# Altium project YYB_V2.PrjPcb
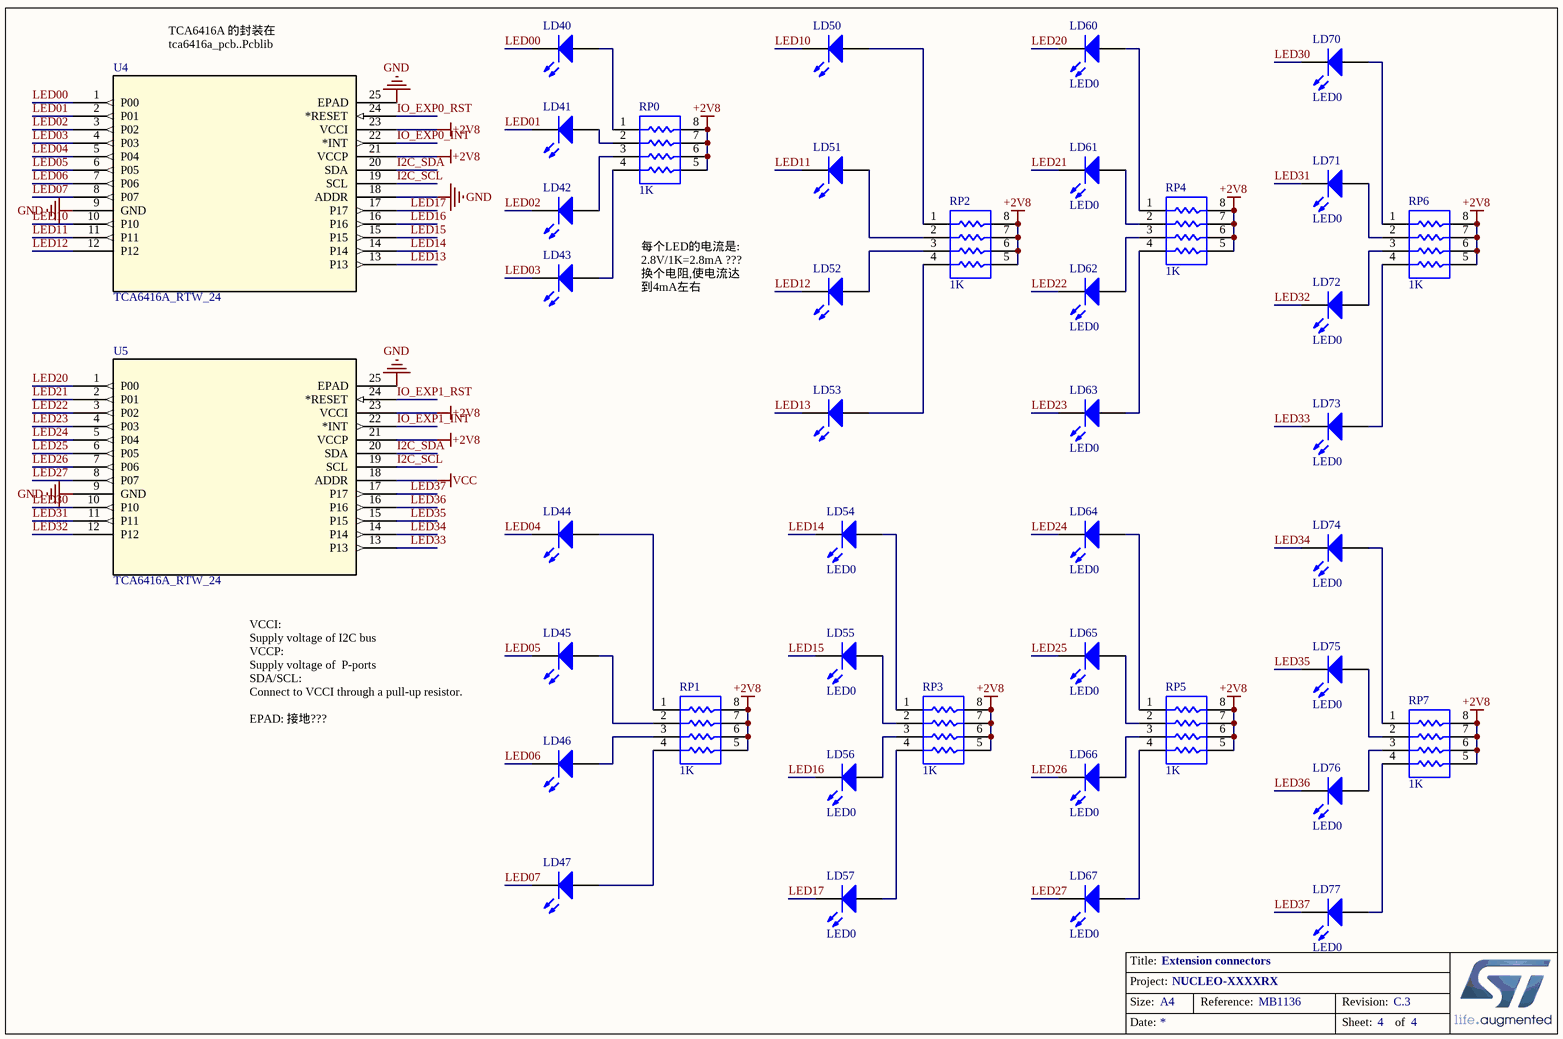
[diagram p0: yyb_v2_Leds.SchDoc]
3 sheets, 95 parts. Net scope: global (net labels, ports and power ports of the same name join across sheets).
Board file: ref_400059.PcbDoc
Sheets:
  yyb_v2_Leds.SchDoc
  ref_pca20006.SchDoc
  yyb_v2_modify.SchDoc

## Sheet yyb_v2_Leds.SchDoc: Extension connectors
size A4; DocumentNumber: MB1136; Revision: C.3; SheetNumber: 4; SheetTotal: 4; Project: NUCLEO-XXXXRX

### Parts
LD40  LED0  [LED5]  (value not drawn)
LD41  LED0  [LED5]  (value not drawn)
LD42  LED0  [LED5]  (value not drawn)
LD43  LED0  [LED5]  (value not drawn)
LD44  LED0  [LED-0]  (value not drawn)
LD45  LED0  [LED-0]  (value not drawn)
LD46  LED0  [LED-0]  (value not drawn)
LD47  LED0  [LED-0]  (value not drawn)
LD50  LED0  [LED-0]  (value not drawn)
LD51  LED0  [LED-0]  (value not drawn)
LD52  LED0  [LED-0]  (value not drawn)
LD53  LED0  [LED-0]  (value not drawn)
LD54  LED0  [LED5]
LD55  LED0  [LED5]
LD56  LED0  [LED5]
LD57  LED0  [LED5]
LD60  LED0  [LED5]
LD61  LED0  [LED5]
LD62  LED0  [LED5]
LD63  LED0  [LED5]
LD64  LED0  [LED5]
LD65  LED0  [LED5]
LD66  LED0  [LED5]
LD67  LED0  [LED5]
LD70  LED0  [LED5]
LD71  LED0  [LED5]
LD72  LED0  [LED5]
LD73  LED0  [LED5]
LD74  LED0  [LED5]
LD75  LED0  [LED5]
LD76  LED0  [LED5]
LD77  LED0  [LED5]
RP0  1K  [4P8]
RP1  1K  [4P8]
RP2  1K  [4P8]
RP3  1K  [4P8]
RP4  1K  [4P8]
RP5  1K  [4P8]
RP6  1K  [4P8]
RP7  1K  [4P8]
U4  TCA6416A_RTW_24  [RTW24_2P45X2P45]
U5  TCA6416A_RTW_24  [RTW24_2P45X2P45]

### Nets
+2V8: RP0.5 RP0.6 RP0.7 RP0.8 RP1.5 RP1.6 RP1.7 RP1.8 RP2.5 RP2.6 RP2.7 RP2.8 RP3.5 RP3.6 RP3.7 RP3.8 RP4.5 RP4.6 RP4.7 RP4.8 RP5.5 RP5.6 RP5.7 RP5.8 RP6.5 RP6.6 RP6.7 RP6.8 RP7.5 RP7.6 RP7.7 RP7.8 U4.21(VCCP) U4.23(VCCI) U5.21(VCCP) U5.23(VCCI)
GND: U4.9(GND) U4.18(ADDR) U4.25(EPAD) U5.9(GND) U5.25(EPAD)
VCC: U5.18(ADDR)
I2C_SCL: U4.19(SCL) U5.19(SCL)
I2C_SDA: U4.20(SDA) U5.20(SDA)
IO_EXP0_INT: U4.22(*INT)
IO_EXP0_RST: U4.24(*RESET)
IO_EXP1_INT: U5.22(*INT)
IO_EXP1_RST: U5.24(*RESET)
LED00: LD40.2(K) U4.1(P00)
LED01: LD41.2(K) U4.2(P01)
LED02: LD42.2(K) U4.3(P02)
LED03: LD43.2(K) U4.4(P03)
LED04: LD44.2(K) U4.5(P04)
LED05: LD45.2(K) U4.6(P05)
LED06: LD46.2(K) U4.7(P06)
LED07: LD47.2(K) U4.8(P07)
LED10: LD50.2(K) U4.10(P10)
LED11: LD51.2(K) U4.11(P11)
LED12: LD52.2(K) U4.12(P12)
LED13: LD53.2(K) U4.13(P13)
LED14: LD54.2(K) U4.14(P14)
LED15: LD55.2(K) U4.15(P15)
LED16: LD56.2(K) U4.16(P16)
LED17: LD57.2(K) U4.17(P17)
LED20: LD60.2(K) U5.1(P00)
LED21: LD61.2(K) U5.2(P01)
LED22: LD62.2(K) U5.3(P02)
LED23: LD63.2(K) U5.4(P03)
LED24: LD64.2(K) U5.5(P04)
LED25: LD65.2(K) U5.6(P05)
LED26: LD66.2(K) U5.7(P06)
LED27: LD67.2(K) U5.8(P07)
LED30: LD70.2(K) U5.10(P10)
LED31: LD71.2(K) U5.11(P11)
LED32: LD72.2(K) U5.12(P12)
LED33: LD73.2(K) U5.13(P13)
LED34: LD74.2(K) U5.14(P14)
LED35: LD75.2(K) U5.15(P15)
LED36: LD76.2(K) U5.16(P16)
LED37: LD77.2(K) U5.17(P17)
NetLD40_1: LD40.1(A) RP0.1
NetLD41_1: LD41.1(A) RP0.2
NetLD42_1: LD42.1(A) RP0.3
NetLD43_1: LD43.1(A) RP0.4
NetLD44_1: LD44.1(A) RP1.1
NetLD45_1: LD45.1(A) RP1.2
NetLD46_1: LD46.1(A) RP1.3
NetLD47_1: LD47.1(A) RP1.4
NetLD50_1: LD50.1(A) RP2.1
NetLD51_1: LD51.1(A) RP2.2
NetLD52_1: LD52.1(A) RP2.3
NetLD53_1: LD53.1(A) RP2.4
NetLD54_1: LD54.1(A) RP3.1
NetLD55_1: LD55.1(A) RP3.2
NetLD56_1: LD56.1(A) RP3.3
NetLD57_1: LD57.1(A) RP3.4
NetLD60_1: LD60.1(A) RP4.1
NetLD61_1: LD61.1(A) RP4.2
NetLD62_1: LD62.1(A) RP4.3
NetLD63_1: LD63.1(A) RP4.4
NetLD64_1: LD64.1(A) RP5.1
NetLD65_1: LD65.1(A) RP5.2
NetLD66_1: LD66.1(A) RP5.3
NetLD67_1: LD67.1(A) RP5.4
NetLD70_1: LD70.1(A) RP6.1
NetLD71_1: LD71.1(A) RP6.2
NetLD72_1: LD72.1(A) RP6.3
NetLD73_1: LD73.1(A) RP6.4
NetLD74_1: LD74.1(A) RP7.1
NetLD75_1: LD75.1(A) RP7.2
NetLD76_1: LD76.1(A) RP7.3
NetLD77_1: LD77.1(A) RP7.4

### Notes on the sheet
- (near U4) TCA6416A 的封装在tca6416a_pcb..Pcblib
- 每个LED的电流是:
  2.8V/1K=2.8mA ???
  换个电阻,使电流达到4mA左右
- VCCI:
  Supply voltage of I2C bus
  VCCP:
  Supply voltage of  P-ports
  SDA/SCL:
  Connect to VCCI through a pull-up resistor.
  EPAD: 接地???
- Title:
- Project:
- Size:
- Date:
- A4
- Reference:
- Sheet:
- Revision:
- of

### Library data of the parts
LD40-LD47 LD50-LD57 LD60-LD67 LD70-LD77 = LED0: Typical INFRARED GaAs LED; Published: 8-Jun-2000; LatestRevisionDate: 08-Jul-2005; LatestRevisionNote: Mech Layer 1 removed.; PackageReference: LED-0; Publisher: Altium Limited; PackageDescription: LED; 2 Leads
RP0-RP7 = RESPACK3_1
U4 U5 = TCA6416A_RTW_24: Imported; Manufacturer: Texas Instruments; INDUSTRY_STD_PKG_TYPE: QFN; FAMILY_NAME: I2C IO EXPANDER; PIN_COUNT: 24; PACKAGE_DESIGNATOR: RTW; Datasheet_URL: http://www.ti.com/lit/gpn/TCA6416A; GENERIC_PART_NUMBER: TCA6416A; Vendor: Texas Instruments; Manufacturer_Part_Number: tca6416a_rtw_24; Value: Value; Type: Type; RefDes: RefDes

## Sheet ref_pca20006.SchDoc: nRF51822 CoinCell design
size A4; Revision: 1.0.0; SheetNumber: 1; SheetTotal: 1; DrawnBy: RUBR; DocumentSize: A4; PCBRevision: 0138RUBR; PCAName: PCA20006; PCBNumber: 400059
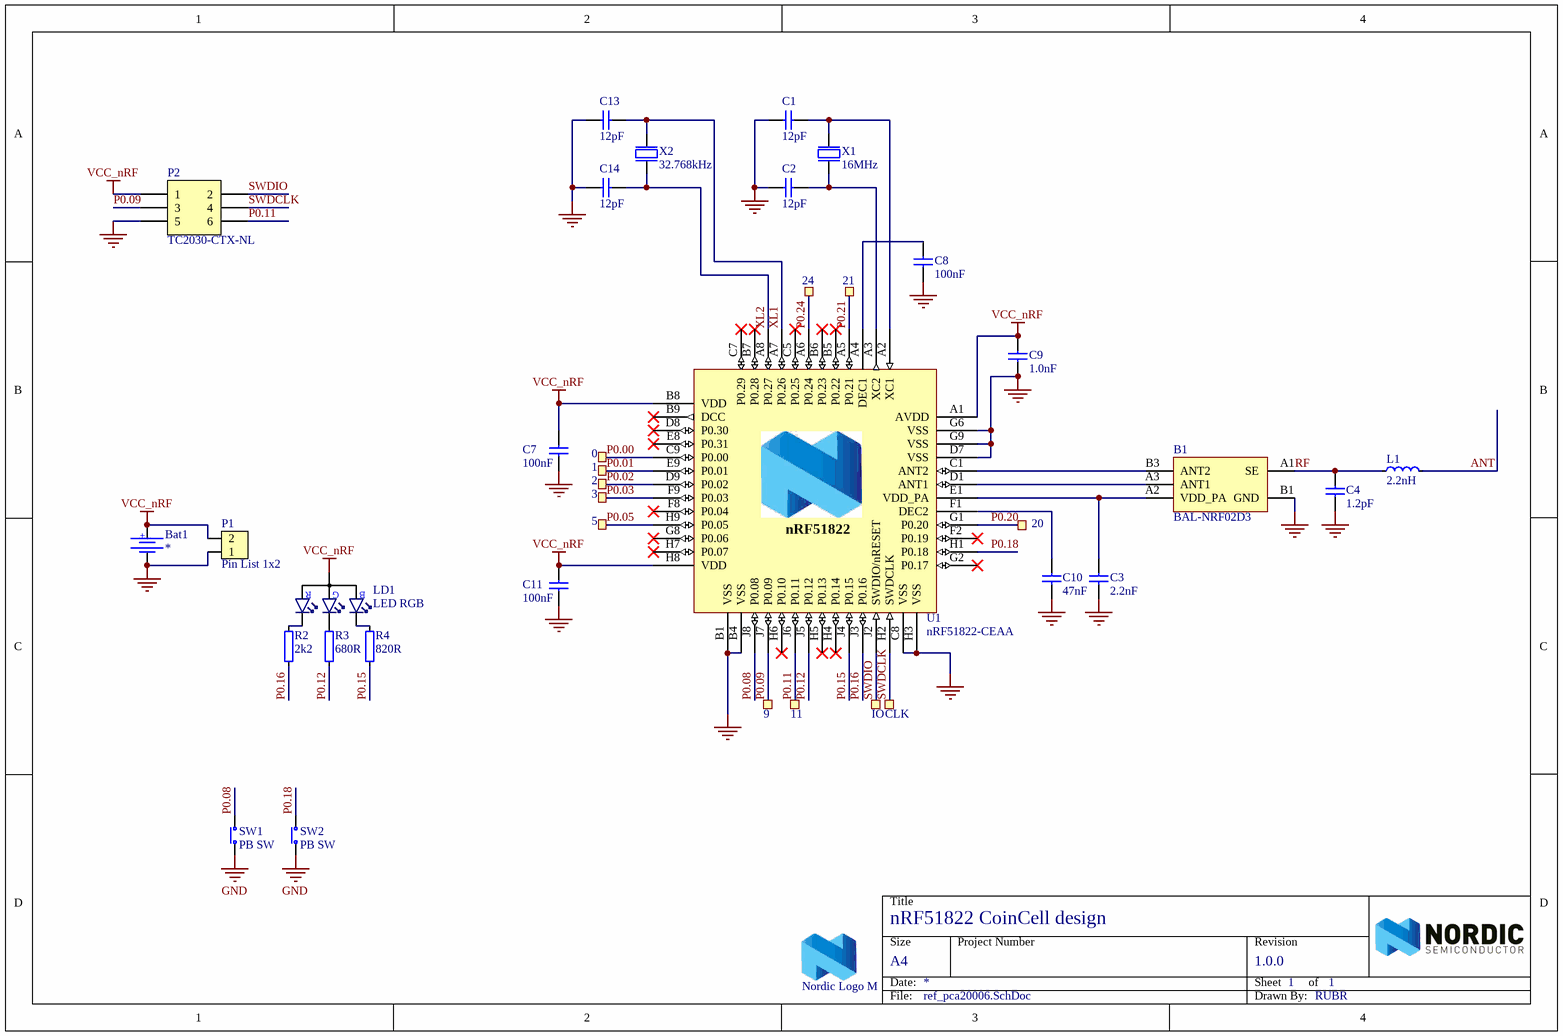
[diagram p1: ref_pca20006.SchDoc]

### Parts
0  Ø1.0mm,SMD  [TP_SMD_Ø1.0mm]  (value not drawn)  (no BOM)
1  Ø1.0mm,SMD  [TP_SMD_Ø1.0mm]  (value not drawn)  (no BOM)
2  Ø1.0mm,SMD  [TP_SMD_Ø1.0mm]  (value not drawn)  (no BOM)
3  Ø1.0mm,SMD  [TP_SMD_Ø1.0mm]  (value not drawn)  (no BOM)
5  Ø1.0mm,SMD  [TP_SMD_Ø1.0mm]  (value not drawn)  (no BOM)
9  Ø1.0mm,SMD  [TP_SMD_Ø1.0mm]  (value not drawn)  (no BOM)
11  Ø1.0mm,SMD  [TP_SMD_Ø1.0mm]  (value not drawn)  (no BOM)
20  Ø1.0mm,SMD  [TP_SMD_Ø1.0mm]  (value not drawn)  (no BOM)
21  Ø1.0mm,SMD  [TP_SMD_Ø1.0mm]  (value not drawn)  (no BOM)
24  Ø1.0mm,SMD  [TP_SMD_Ø1.0mm]  (value not drawn)  (no BOM)
B1  BAL-NRF02D3  [BAL-ST-WLCSP]
Bat1  *  [CR1632_HOLDER_SMD]
C1  12pF  [CAPC1005X04L]
C2  12pF  [CAPC1005X04L]
C3  2.2nF  [CAPC1005X04L]
C4  1.2pF  [CAPC1005X04L]
C7  100nF  [CAPC1005X04L]
C8  100nF  [CAPC1005X04L]
C9  1.0nF  [CAPC1005X04L]
C10  47nF  [CAPC1005X04L]
C11  100nF  [CAPC1005X04L]
C13  12pF  [CAPC1005X04L]
C14  12pF  [CAPC1005X04L]
CLK  Ø1.0mm,SMD  [TP_SMD_Ø1.0mm]  (value not drawn)  (no BOM)
IO  Ø1.0mm,SMD  [TP_SMD_Ø1.0mm]  (value not drawn)  (no BOM)
L1  2.2nH  [INDC1005X04L]
LD1  LED RGB  [SML-LX0404SIUPGUSB]
LOGO1  Nordic Logo M  [NORDIC_LOGO_M]  (no BOM)
P1  Pin List 1x2  [LIST_1x2]
P2  TC2030-CTX-NL  [TC2030-IDC-NLFP]  (no BOM)
R2  2k2  [RESC1005X04L]
R3  680R  [RESC1005X04L]
R4  820R  [RESC1005X04L]
SW1  PB SW  [SW_TACTILE_2.6x3.0MM_4-LEAD]
SW2  PB SW  [SW_TACTILE_2.6x3.0MM_4-LEAD]
U1  nRF51822-CEAA  [BGA62C40P9X9_383X350X55]
X1  16MHz  [BT-XTAL_2520]
X2  32.768kHz  [FC-135]

### Nets
GND: B1.B1(GND) Bat1.2 C1.1 C2.1 C3.1 C4.1 C7.1 C8.2 C9.1 C10.1 C11.1 C13.1 C14.1 P1.1 P2.5 SW1.2(COM) SW2.2(COM) U1.B1(VSS) U1.B4(VSS) U1.C8(VSS) U1.D7(VSS) U1.G3(N.C.) U1.G4(N.C.) U1.G6(VSS) U1.G9(VSS) U1.H3(VSS) X1.2(GND) X1.4(GND)
VCC_nRF: Bat1.1 C7.2 C9.2 C11.2 LD1.4(A) P1.2 P2.1 U1.A1(AVDD) U1.B8(VDD) U1.H8(VDD)
ANT: L1.2
P0.00: 0.1 U1.C9(P0.00)
P0.01: 1.1 U1.E9(P0.01)
P0.02: 2.1 U1.D9(P0.02)
P0.03: 3.1 U1.F9(P0.03)
P0.05: 5.1 U1.H9(P0.05)
P0.08: SW1.1(N.O) U1.J8(P0.08)
P0.09: 9.1 P2.3 U1.J7(P0.09)
P0.11: 11.1 P2.6 U1.J6(P0.11)
P0.12: R3.1 U1.J5(P0.12)
P0.15: R4.1 U1.J4(P0.15)
P0.16: R2.1 U1.J3(P0.16)
P0.18: SW2.1(N.O) U1.H1(P0.18)
P0.20: 20.1 U1.G1(P0.20)
P0.21: 21.1 U1.A5(P0.21)
P0.24: 24.1 U1.A6(P0.24)
RF: B1.A1(SE) C4.2 L1.1
SWDCLK: CLK.1 P2.4 U1.H2(SWDCLK)
SWDIO: IO.1 P2.2 U1.J2(SWDIO/nRESET)
XL1: C13.2 U1.A7(P0.26) X2.1(inp)
XL2: C14.2 U1.A8(P0.27) X2.2(out)
NetB1_A2: B1.A2(VDD_PA) C3.2 U1.E1(VDD_PA)
NetB1_A3: B1.A3(ANT1) U1.D1(ANT1)
NetB1_B3: B1.B3(ANT2) U1.C1(ANT2)
NetC1_2: C1.2 U1.A2(XC1) X1.1(inp)
NetC2_2: C2.2 U1.A3(XC2) X1.3(out)
NetC8_1: C8.1 U1.A4(DEC1)
NetC10_2: C10.2 U1.F1(DEC2)
NetLD1_1: LD1.1(C_RED) R2.2
NetLD1_2: LD1.2(C_GREEN) R3.2
NetLD1_3: LD1.3(C_BLUE) R4.2

Not connected (* = marked no-connect by the designer): U1 B5(P0.22)* B6(P0.23)* B7(P0.28)* B9(DCC)* C5(P0.25)* C7(P0.29)* D8(P0.30)* E8(P0.31)* F2(P0.19)* F8(P0.04)* G2(P0.17)* G8(P0.06)* H4(P0.14)* H5(P0.13)* H6(P0.10)* H7(P0.07)*

### Notes on the sheet
- Title
- Size
- Date:
- Project Number
- Sheet         of
- Revision
- File:
- Drawn By:
- (in symbol Bat Holder CR1632 SMD) +
- (in symbol nRF51822-CEAAD0) nRF51822
- (in symbol SML-LX0404SIUPGUSB) R; G; B

### Library data of the parts
0-3 5 9 11 20 21 24 CLK IO = TP_SMD_Ø1.0MM: 1.0mm circular SMD testpad; Manufacturer: Nordic Semiconductor; Artikkelnr Noca: N.A.; Part Number: TP_SMD_Ø1.0MM; Manufacturer Part Number: *; Datasheet: *; LatestRevisionDate: 2013-06-11; Pin Count: 1; Publisher: Nordic Semiconductor; Published: 2013-06-11; Value: Ø1.0mm,SMD; Note: *; Supplier: *; Supplier part number: *; 2nd source Supplier: *; 2nd source part number: *
B1 = BAL-NRF02D3: 50 ohm balun transformer for 2.45GHz ISM; Manufacturer: STMicroelectronics; Artikkelnr Noca: N.A.; Part Number: BAL-NRF02D3; Manufacturer Part Number: BAL-NRF02D3; Datasheet: *; LatestRevisionDate: 2013-05-15; Pin Count: 5; Publisher: Nordic Semiconductor; Published: 2013-05-15; Value: BAL-NRF02D3; Note: BAL-NRF02D3; Supplier: *; Supplier part number: *; 2nd source Supplier: *; 2nd source part number: *
Bat1 = Bat Holder CR1632 SMD: Manufacturer: Keystone; Manufacturer Part Number: 3012; 2nd source part number: 165-0697; Artikkelnr Noca: N.A.; Part Number: Bat Holder CR1632 SMD; Datasheet: http://www.keyelco.com/product-pdf.cfm?p=790; LatestRevisionDate: 2014-01-13; Pin Count: 3; Publisher: Nordic Semiconductor; Published: 2014-01-13; Value: Bat Holder CR1632; Note: *; Supplier: Digi-Key; Supplier part number: 3012K-ND; 2nd source Supplier: Farnell
C1 C2 C13 C14 = C0402-12p: Capacitor, NP0, ±2%; Note: 50V; Artikkelnr Noca: 20029159; Part Number: C0402-12p; Manufacturer: *; Manufacturer Part Number: *; Datasheet: *; Footprint: 0402; LatestRevisionDate: 2011-05-11; Pin Count: 2; Publisher: Nordic Semiconductor; Published: 2009-05-08; Value: 12pF; Supplier: *; Supplier part number: *; 2nd source Supplier: *; 2nd source part number: *
C3 = C0402-2n2: Capacitor, X7R, ±10%; Note: 50V; Artikkelnr Noca: 20039221; Part Number: C0402-2n2; Manufacturer: *; Manufacturer Part Number: *; Datasheet: *; Footprint: 0402; LatestRevisionDate: 2009-11-23; Pin Count: 2; Publisher: Nordic Semiconductor; Published: 2009-05-08; Value: 2.2nF; Supplier: *; Supplier part number: *; 2nd source Supplier: *; 2nd source part number: *
C4 = C0402-1.2p: Capacitor, NP0, ±0.1pF; Note: 50V; Artikkelnr Noca: 20029157; Part Number: C0402-1.2p; Manufacturer: *; Manufacturer Part Number: *; Datasheet: *; Footprint: 0402; LatestRevisionDate: 2011-05-11; Pin Count: 2; Publisher: Nordic Semiconductor; Published: 2009-05-08; Value: 1.2pF; Supplier: *; Supplier part number: *; 2nd source Supplier: *; 2nd source part number: *
C7 C8 C11 = C0402-100n: Capacitor, X7R, ±10%; Note: 16V; Artikkelnr Noca: 20039200; Part Number: C0402-100n; Manufacturer: *; Manufacturer Part Number: *; Datasheet: *; Footprint: 0402; LatestRevisionDate: 2009-11-23; Pin Count: 2; Publisher: Nordic Semiconductor; Published: 2009-05-08; Value: 100nF; Supplier: *; Supplier part number: *; 2nd source Supplier: *; 2nd source part number: *
C9 = C0402-1n0: Capacitor, X7R, ±10%; Note: 50V; Artikkelnr Noca: 20039223; Part Number: C0402-1n0; Manufacturer: *; Manufacturer Part Number: *; Datasheet: *; Footprint: 0402; LatestRevisionDate: 2009-11-23; Pin Count: 2; Publisher: Nordic Semiconductor; Published: 2009-05-08; Value: 1.0nF; Supplier: *; Supplier part number: *; 2nd source Supplier: *; 2nd source part number: *
C10 = C0402-47n: Capacitor, X7R, ±10%; Note: Chip Cap 10%; Artikkelnr Noca: 20039389; Part Number: C0402-47n; Manufacturer: *; Manufacturer Part Number: *; Datasheet: *; Footprint: 0402; LatestRevisionDate: 2009-05-08; Pin Count: 2; Publisher: Nordic Semiconductor; Published: 2009-05-08; Value: 47nF; Supplier: *; Supplier part number: *; 2nd source Supplier: *; 2nd source part number: *
L1 = L0402-2n2: Inductor, 220mA, ±0.1nH; Manufacturer: Murata; Manufacturer Part Number: LQP15MN2N2B02D; Note: High frequency chip inductor ±5%; Artikkelnr Noca: 33029257; Part Number: L0402-2n2; Datasheet: http://search.murata.co.jp/Ceramy/image/img/PDF/ENG/L0075S0084LQP15M.pdf; Footprint: 0402; LatestRevisionDate: 2012-09-19; Pin Count: 2; Publisher: Nordic Semiconductor; Published: 2009-05-08; Value: 2.2nH; Supplier: Digi-Key; Supplier part number: 490-1128-1-ND; 2nd source Supplier: *; 2nd source part number: *
LD1 = SML-LX0404SIUPGUSB: RGB LED 1.00 mm x 1.00 mm SMD; Manufacturer: Lumex; 2nd source part number: 211-8843; Artikkelnr Noca: 13019150; Part Number: SML-LX0404SIUPGUSB; Manufacturer Part Number: SML-LX0404SIUPGUSB; Datasheet: http://media.digikey.com/pdf/Data%20Sheets/Lumex%20PDFs/SML-LX0404SIUPGUSB.pdf; LatestRevisionDate: 2012-10-08; Pin Count: 4; Publisher: Nordic Semiconductor; Published: 2012-10-08; Value: LED RGB; Note: *; Supplier: Digi-Key; Supplier part number: 67-2125-1-ND; 2nd source Supplier: Farnell
LOGO1 = Nordic Logo M: Nordic Logo, medium size; Artikkelnr Noca: N.A.; Part Number: Nordic Logo M; Manufacturer: *; Manufacturer Part Number: *; Datasheet: *; LatestRevisionDate: 2010-02-18; Publisher: Nordic Semiconductor; Value: Nordic Logo M; Note: *; Supplier: *; Supplier part number: *; 2nd source Supplier: *; 2nd source part number: *; Pin Count: 2; Published: 2010-02-18
P1 = Pin List 1x2: Pin List 1x2, 2.54mm (100mil); Artikkelnr Noca: 56019040; Part Number: Pin List 1x2; Manufacturer: *; Manufacturer Part Number: *; Datasheet: *; LatestRevisionDate: 2009-12-12; Pin Count: 2; Publisher: Nordic Semiconductor; Published: 2009-12-12; Value: Pin List 1x2; Note: *; Supplier: *; Supplier part number: *; 2nd source Supplier: *; 2nd source part number: *
P2 = TC2030-CTX-NL: CBL PLUG-OF-NAILS 6-PIN; Manufacturer: Tag-Connect LLC; Artikkelnr Noca: N.A.; Part Number: TC2030-CTX-NL; Manufacturer Part Number: TC2030-CTX-NL; Datasheet: http://www.tag-connect.com/Materials/TC2030-IDC-NL.pdf; LatestRevisionDate: 2013-08-08; Pin Count: 6; Publisher: Nordic Semiconductor; Published: 2013-08-08; Value: TC2030-CTX-NL; Supplier: Tag-Connect; Supplier part number: TC2030-CTX-NL; 2nd source Supplier: *; 2nd source part number: *
R2 = R0402-2k2: Resistor, ±1%, 0.063W; Note: Chip Res 1%; Artikkelnr Noca: 27049081; Part Number: R0402-2k2; Manufacturer: *; Manufacturer Part Number: *; Datasheet: *; Footprint: 0402; LatestRevisionDate: 2009-11-23; Pin Count: 2; Publisher: Nordic Semiconductor; Published: 2009-05-08; Value: 2k2; Supplier: Farnell; Supplier part number: 173-8854; 2nd source Supplier: *; 2nd source part number: *
R3 = R0402-680: Resistor, ±1%, 0.063W; Note: Chip Res 1%; Artikkelnr Noca: 27049069; Part Number: R0402-680; Manufacturer: *; Manufacturer Part Number: *; Datasheet: *; Footprint: 0402; LatestRevisionDate: 2009-11-23; Pin Count: 2; Publisher: Nordic Semiconductor; Published: 2009-05-08; Value: 680R; Supplier: Farnell; Supplier part number: 173-8848; 2nd source Supplier: *; 2nd source part number: *
R4 = R0402-820: Resistor, ±1%, 0.063W; Note: Chip Res 1%; Artikkelnr Noca: 27049071; Part Number: R0402-820; Manufacturer: *; Manufacturer Part Number: *; Datasheet: *; Footprint: 0402; LatestRevisionDate: 2009-11-23; Pin Count: 2; Publisher: Nordic Semiconductor; Published: 2009-05-08; Value: 820R; Supplier: Farnell; Supplier part number: 173-8849; 2nd source Supplier: *; 2nd source part number: *
SW1 SW2 = KMT021 NGJ LHS: Nano-Miniature Top Actuated Tact Switch with extended life 3.0x2.6mm; Manufacturer: C & K; 2nd source part number: 190-8260; Artikkelnr Noca: N.A.; Part Number: KMT021 NGJ LHS; Manufacturer Part Number: KMT021 NGJ LHS; Datasheet: http://media.digikey.com/pdf/Data%20Sheets/C&K/KMT_0xx_NGJ_LHS_Drawing.pdf; LatestRevisionDate: 2013-08-12; Pin Count: 4; Publisher: Nordic Semiconductor; Published: 2013-08-12; Value: PB SW; Note: *; Supplier: Digi-Key; Supplier part number: CKN10289CT-ND; 2nd source Supplier: Farnell
U1 = nRF51822-CEAAD0: Multi-protocol Bluetooth Low Energy and 2.4GHz proprietary system-on-chip; Manufacturer: Nordic Semiconductor; Note: nRF51822 XLR2.4 - WLCSP62 3.8x3.5 0.4mm pitch; Artikkelnr Noca: N.A.; Part Number: nRF51822-CEAAD0; Manufacturer Part Number: nRF51822-CEAAD0; Datasheet: *; Footprint: WLCSP_C62; LatestRevisionDate: 2013-10-25; Pin Count: 62; Publisher: Nordic Semiconductor; Published: 2013-10-25; Value: nRF51822-CEAA; Supplier: Nordic Semiconductor; Supplier part number: *; 2nd source Supplier: *; 2nd source part number: *
X1 = NX2520SA-16MHZ-STD-CSW-5: XTAL SMD 2520, 16MHz, 8pF, ±15ppm; Manufacturer: NDK; Note: XTAL SMD 16.000MHz; Artikkelnr Noca: 22019192; Part Number: NX2520SA-16MHZ-STD-CSW-5; Manufacturer Part Number: NX2520SA-16MHZ-STD-CSW-5; Datasheet: http://www.ndk.com/images/products/catalog/c_NX2520SA-STD-CSW-5_e.pdf; LatestRevisionDate: 2012-06-15; Pin Count: 4; Publisher: Nordic Semiconductor; Published: 2012-06-15; Value: 16MHz; Supplier: Digi-Key; Supplier part number: 644-1169-1-ND; 2nd source Supplier: *; 2nd source part number: *
X2 = XTAL_FC-135 32.768k: EPSON TOYOCOM - FC-135 32.768KHZ ±20PPM,9.0PF - CRYSTAL, SM, WATCH; 2nd source part number: 127-8037; Note: XTAL SMD 32.768kHz, 3215; Artikkelnr Noca: 22019091; Part Number: XTAL_FC-135 32.768k; Manufacturer: Epson Toyocom; Manufacturer Part Number: FC-135 32.768KHZ ±20PPM,9.0PF; Datasheet: http://www.farnell.com/datasheets/57480.pdf; LatestRevisionDate: 2010-10-18; Pin Count: 2; Publisher: Nordic Semiconductor; Published: 2010-10-18; Value: 32.768kHz; Supplier: Digi-Key; Supplier part number: FC-135 32.7680KA-AC-ND; 2nd source Supplier: Farnell

## Sheet yyb_v2_modify.SchDoc
size A4
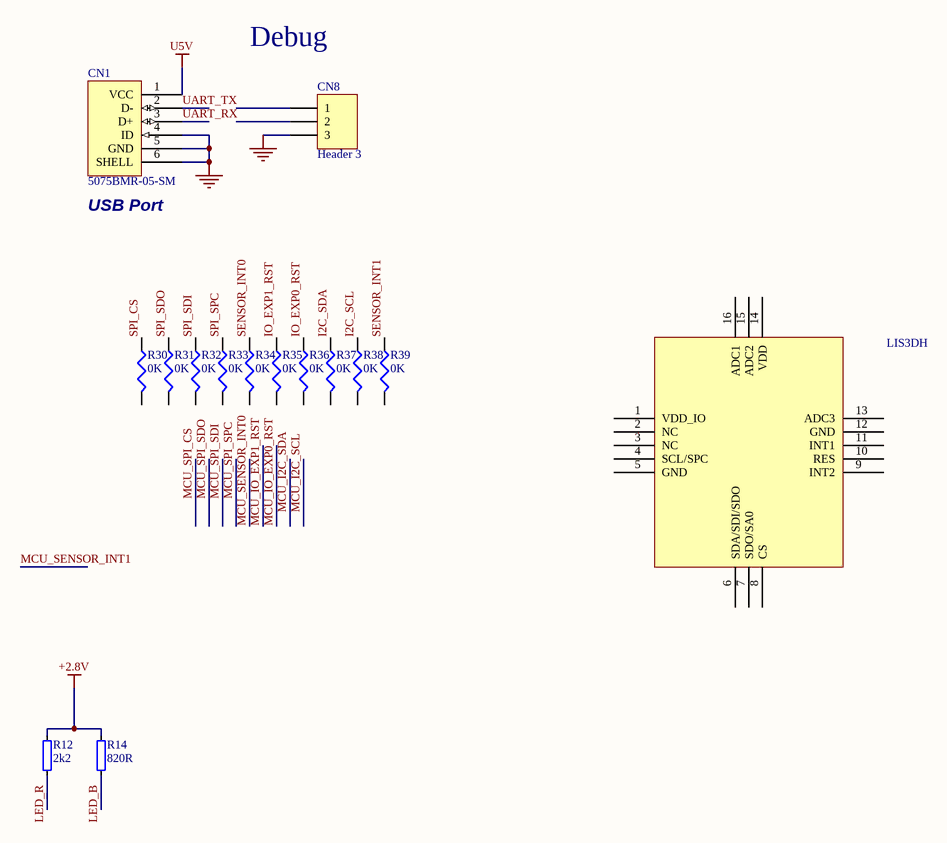
[diagram p2: yyb_v2_modify.SchDoc]

### Parts
?  LIS3DH
CN1  5075BMR-05-SM  [USB-MINI-B-SMD]
CN8  Header 3  [HDR1X3]
R12  2k2  [RESC1005X04L]
R14  820R  [RESC1005X04L]
R30  value 0K  [J1-0603]  (hidden comment: 0R)
R31  value 0K  [J1-0603]  (hidden comment: 0R)
R32  value 0K  [J1-0603]  (hidden comment: 0R)
R33  value 0K  [J1-0603]  (hidden comment: 0R)
R34  value 0K  [J1-0603]  (hidden comment: 0R)
R35  value 0K  [J1-0603]  (hidden comment: 0R)
R36  value 0K  [J1-0603]  (hidden comment: 0R)
R37  value 0K  [J1-0603]  (hidden comment: 0R)
R38  value 0K  [J1-0603]  (hidden comment: 0R)
R39  value 0K  [J1-0603]  (hidden comment: 0R)

### Nets
+2.8V: R12.2 R14.2
GND: CN1.4(ID) CN1.5(GND) CN1.6(SHELL) CN8.3
U5V: CN1.1(VCC)
I2C_SCL: R38.1
I2C_SDA: R37.1
IO_EXP0_RST: R36.1
IO_EXP1_RST: R35.1
SENSOR_INT0: R34.1
SENSOR_INT1: R39.1
SPI_CS: R30.1
SPI_SDI: R32.1
SPI_SDO: R31.1
SPI_SPC: R33.1
UART_RX: CN1.3(D+)
UART_TX: CN1.2(D-)

Not connected (* = marked no-connect by the designer): ? 1(VDD_IO) 2(NC) 3(NC) 4(SCL/SPC) 5(GND) 6(SDA/SDI/SDO) 7(SDO/SA0) 8(CS) 9(INT2) 10(RES) 11(INT1) 12(GND) 13(ADC3) 14(VDD) 15(ADC2) 16(ADC1); CN8 1 2; R12 1; R14 1; R30 2; R31 2; R32 2; R33 2; R34 2; R35 2; R36 2; R37 2; R38 2; R39 2

### Notes on the sheet
- Debug
- (near CN1) USB Port
- Labels drawn without touching a wire or pin: LED_B, LED_R

### Library data of the parts
CN1 = USB-MINI-typeB connector: Manuf_Part_1: 5075BMR-05-SM; Order: 5075BMR-05-SM; ECCN: ????
CN8 = Header 3: Header, 3-Pin; LatestRevisionDate: 17-Jul-2002; LatestRevisionNote: Re-released for DXP Platform.; Publisher: Altium Limited
R12 = R0402-2k2: Resistor, ?%, 0.063W; Note: Chip Res 1%; Artikkelnr Noca: 27049081; Part Number: R0402-2k2; Manufacturer: *; Manufacturer Part Number: *; Datasheet: *; Footprint: 0402; LatestRevisionDate: 2009-11-23; Pin Count: 2; Publisher: Nordic Semiconductor; Published: 2009-05-08; Value: 2k2; Supplier: Farnell; Supplier part number: 173-8854; 2nd source Supplier: *; 2nd source part number: *
R14 = R0402-820: Resistor, ?%, 0.063W; Note: Chip Res 1%; Artikkelnr Noca: 27049071; Part Number: R0402-820; Manufacturer: *; Manufacturer Part Number: *; Datasheet: *; Footprint: 0402; LatestRevisionDate: 2009-11-23; Pin Count: 2; Publisher: Nordic Semiconductor; Published: 2009-05-08; Value: 820R; Supplier: Farnell; Supplier part number: 173-8849; 2nd source Supplier: *; 2nd source part number: *
R30-R39 = Res3: Resistor; Published: 8-Jun-2000; LatestRevisionDate: 29-May-2009; LatestRevisionNote: IPC-7351 Footprint Added.; PackageReference: J1-0603; Publisher: Altium Limited; PackageDescription: Chip Resistor

## Nets that join several sheets
GND: yyb_v2_Leds (5 pins), ref_pca20006 (28 pins), yyb_v2_modify (CN1.4 CN1.5 CN1.6 CN8.3)
I2C_SCL: yyb_v2_Leds (U4.19 U5.19), yyb_v2_modify (R38.1)
I2C_SDA: yyb_v2_Leds (U4.20 U5.20), yyb_v2_modify (R37.1)
IO_EXP0_RST: yyb_v2_Leds (U4.24), yyb_v2_modify (R36.1)
IO_EXP1_RST: yyb_v2_Leds (U5.24), yyb_v2_modify (R35.1)